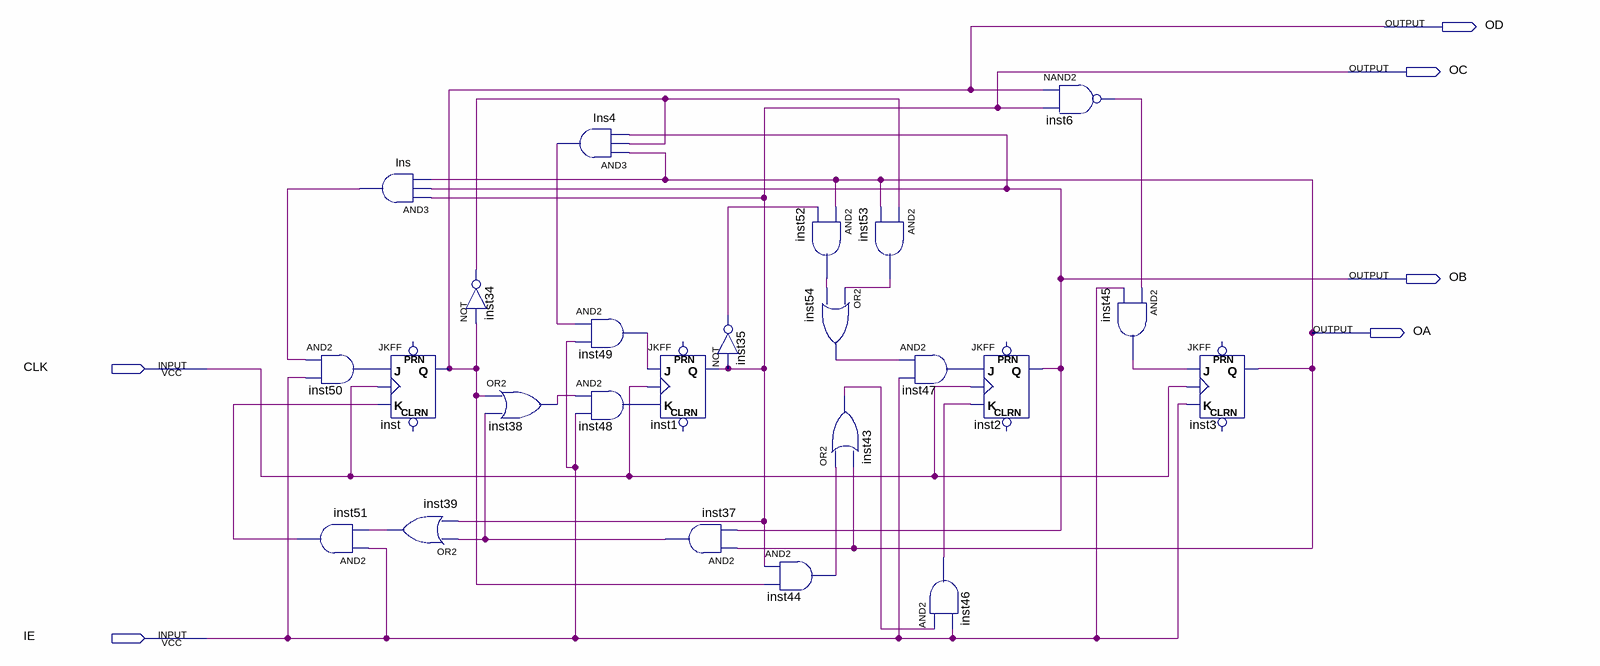
[diagram p0: schematic sheet]
// Quartus schematic mod_12_counter_with_enable.bdf as structural Verilog: 24 symbols, 6 pins
module mod_12_counter_with_enable (
  input  CLK,
  input  IE,
  output OD,
  output OC,
  output OB,
  output OA
);

  wire Ins4_out, Ins_out, inst6_out, inst34_out, inst35_out, inst37_out, inst38_out, inst39_out, inst43_out,
       inst44_out, inst45_out, inst46_out, inst47_out, inst48_out, inst49_out, inst50_out, inst51_out,
       inst52_out, inst53_out, inst54_out;

  and inst51 (inst51_out, IE, inst39_out);
  and Ins (Ins_out, OC, OB, OA);
  and inst50 (inst50_out, Ins_out, IE);
  JKFF inst (.K(inst51_out), .J(inst50_out), .CLK(CLK), .Q(OD));  // open: PRN, CLRN
  or inst39 (inst39_out, inst37_out, OC);
  not inst34 (inst34_out, OD);
  or inst38 (inst38_out, OD, inst37_out);
  and Ins4 (Ins4_out, OA, inst34_out, OB);
  and inst49 (inst49_out, Ins4_out, IE);
  and inst48 (inst48_out, inst38_out, IE);
  JKFF inst1 (.K(inst48_out), .J(inst49_out), .CLK(CLK), .Q(OC));  // open: PRN, CLRN
  not inst35 (inst35_out, OC);
  and inst37 (inst37_out, OA, OB);
  and inst52 (inst52_out, OA, inst35_out);
  and inst44 (inst44_out, OC, OD);
  and inst53 (inst53_out, inst34_out, OA);
  or inst54 (inst54_out, inst53_out, inst52_out);
  or inst43 (inst43_out, inst44_out, OA);
  and inst47 (inst47_out, inst54_out, IE);
  and inst46 (inst46_out, inst43_out, IE);
  JKFF inst2 (.K(inst46_out), .J(inst47_out), .CLK(CLK), .Q(OB));  // open: PRN, CLRN
  nand inst6 (inst6_out, OD, OC);
  and inst45 (inst45_out, inst6_out, IE);
  JKFF inst3 (.K(IE), .J(inst45_out), .CLK(CLK), .Q(OA));  // open: PRN, CLRN
endmodule
